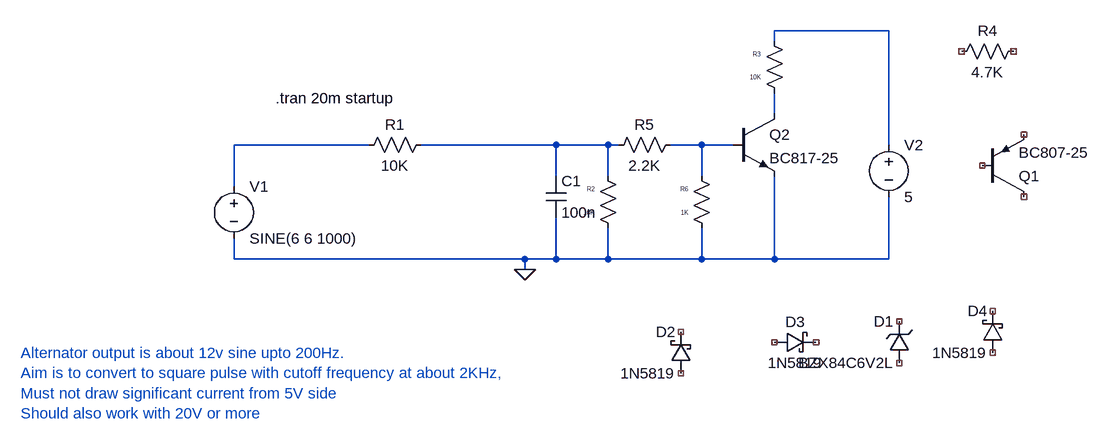
[diagram p0: schematic Draft2.asc]
Draft2.asc, the LTspice schematic file:
Version 4
SHEET 1 1172 680
WIRE 864 48 688 48
WIRE 688 64 688 48
WIRE 688 176 688 144
WIRE 64 224 -144 224
WIRE 352 224 144 224
WIRE 432 224 352 224
WIRE 448 224 432 224
WIRE 576 224 528 224
WIRE 624 224 576 224
WIRE 864 224 864 48
WIRE 352 272 352 224
WIRE 432 272 432 224
WIRE 576 272 576 224
WIRE -144 288 -144 224
WIRE -144 400 -144 368
WIRE 304 400 -144 400
WIRE 352 400 352 336
WIRE 352 400 304 400
WIRE 432 400 432 352
WIRE 432 400 352 400
WIRE 576 400 576 352
WIRE 576 400 432 400
WIRE 688 400 688 272
WIRE 688 400 576 400
WIRE 864 400 864 304
WIRE 864 400 688 400
WIRE 304 416 304 400
FLAG 304 416 0
SYMBOL res 160 208 R90
WINDOW 0 0 56 VBottom 2
WINDOW 3 32 56 VTop 2
SYMATTR InstName R1
SYMATTR Value 10K
SYMBOL res 448 368 R180
WINDOW 0 36 76 Left 0
WINDOW 3 36 40 Left 0
SYMATTR InstName R2
SYMATTR Value 10K
SYMBOL cap 336 272 R0
SYMATTR InstName C1
SYMATTR Value 100n
SYMATTR SpiceLine Rser=50.1m Lser=0 mfg="   ---" pn="   ---" type="   ---"
SYMBOL zener 896 560 R180
WINDOW 0 24 64 Left 2
WINDOW 3 24 0 Left 2
SYMATTR InstName D1
SYMATTR Value BZX84C6V2L
SYMBOL schottky 560 576 R180
WINDOW 0 24 64 Left 2
WINDOW 3 24 0 Left 2
SYMATTR InstName D2
SYMATTR Value 1N5819
SYMATTR Description Diode
SYMATTR Type diode
SYMBOL voltage -144 272 R0
SYMATTR InstName V1
SYMATTR Value SINE(6 6 1000)
SYMBOL schottky 688 544 R270
WINDOW 0 32 32 VTop 2
WINDOW 3 0 32 VBottom 2
SYMATTR InstName D3
SYMATTR Value 1N5819
SYMATTR Description Diode
SYMATTR Type diode
SYMBOL schottky 1040 544 R180
WINDOW 0 24 64 Left 2
WINDOW 3 24 0 Left 2
SYMATTR InstName D4
SYMATTR Value 1N5819
SYMATTR Description Diode
SYMATTR Type diode
SYMBOL voltage 864 208 R0
SYMATTR InstName V2
SYMATTR Value 5
SYMATTR SpiceLine Rser=20
SYMBOL pnp 1008 304 M180
SYMATTR InstName Q1
SYMATTR Value BC807-25
SYMBOL res 704 160 R180
WINDOW 0 36 76 Left 0
WINDOW 3 36 40 Left 0
SYMATTR InstName R3
SYMATTR Value 10K
SYMBOL res 1072 64 R90
WINDOW 0 0 56 VBottom 2
WINDOW 3 32 56 VTop 2
SYMATTR InstName R4
SYMATTR Value 4.7K
SYMBOL res 544 208 R90
WINDOW 0 0 56 VBottom 2
WINDOW 3 32 56 VTop 2
SYMATTR InstName R5
SYMATTR Value 2.2K
SYMBOL npn 624 176 R0
SYMATTR InstName Q2
SYMATTR Value BC817-25
SYMBOL res 592 368 R180
WINDOW 0 36 76 Left 0
WINDOW 3 36 40 Left 0
SYMATTR InstName R6
SYMATTR Value 1K
TEXT -80 152 Left 2 !.tran 20m startup
TEXT -472 544 Left 2 ;Alternator output is about 12v sine upto 200Hz. \nAim is to convert to square pulse with cutoff frequency at about 2KHz,\nMust not draw significant current from 5V side\nShould also work with 20V or more

The netlist it stands for:
* Draft2.asc
R1 N004 N003 10K
R2 0 N004 10K
C1 N004 0 100n Rser=50.1m Lser=0 mfg="   ---" pn="   ---" type="   ---"
D1 NC_01 NC_02 BZX84C6V2L
D2 NC_03 NC_04 1N5819
V1 N003 0 SINE(6 6 1000)
D3 NC_05 NC_06 1N5819
D4 NC_07 NC_08 1N5819
V2 N001 0 5 Rser=20
Q1 NC_09 NC_10 NC_11 0 BC807-25
R3 N002 N001 10K
R4 NC_12 NC_13 4.7K
R5 N005 N004 2.2K
Q2 N002 N005 0 0 BC817-25
R6 0 N005 1K
.model D D
.lib standard.dio
.model NPN NPN
.model PNP PNP
.lib standard.bjt
.tran 20m startup
* Alternator output is about 12v sine upto 200Hz.
* Aim is to convert to square pulse with cutoff frequency at about 2KHz,
* Must not draw significant current from 5V side
* Should also work with 20V or more
.backanno
.end